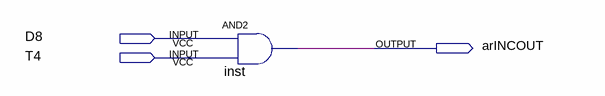
[diagram p0: schematic sheet]
// Quartus schematic arINC.bdf as structural Verilog: 1 symbols, 3 pins
module arINC (
  input  D8,
  input  T4,
  output arINCOUT
);

  and inst (arINCOUT, D8, T4);
endmodule
